# Altium project AC Current Sensor (Multicanal).PrjPcb
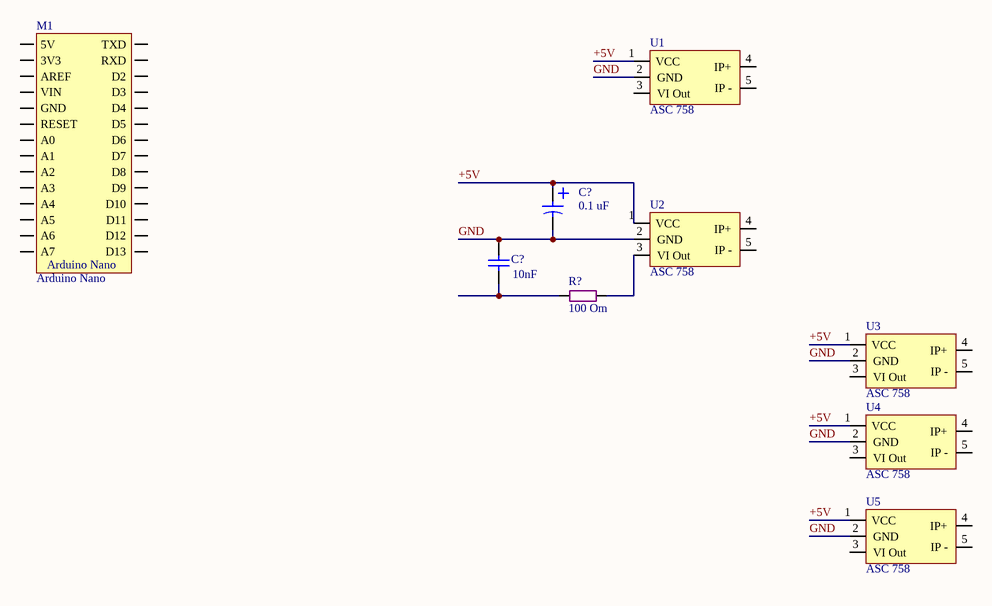
[diagram p0: AC Current Sensor (Multicanal).SchDoc]
1 sheet, 9 parts. Net scope: global (net labels, ports and power ports of the same name join across sheets).
Board file: AC Current Sensor (Multicanal).PcbDoc

## Sheet AC Current Sensor (Multicanal).SchDoc
size A4

### Parts
(Parts that share a designator on the sheet are numbered #1, #2 ... from top to bottom, then left to right.)
C?#1  0.1 uF  [SMD 1206 Tantal (3216)]
C?#2  10nF  [SMD 0805 (2012)]
M1  Arduino Nano  [Arduino Nano]
R?  100 Om  [SMD 0805 (2012)]
U1  ASC 758  [CB-PFF (ACS758)]
U2  ASC 758  [CB-PFF (ACS758)]
U3  ASC 758  [CB-PFF (ACS758)]
U4  ASC 758  [CB-PFF (ACS758)]
U5  ASC 758  [CB-PFF (ACS758)]

### Nets
+5V: C?#1.VCC U1.1(VCC) U2.1(VCC) U3.1(VCC) U4.1(VCC) U5.1(VCC)
GND: C?#1.GND C?#2.1 U1.2(GND) U2.2(GND) U3.2(GND) U4.2(GND) U5.2(GND)
NetC?#2_2: C?#2.2 R?.1
NetR?_2: R?.2 U2.3(VI_Out)

Not connected (* = marked no-connect by the designer): M1 3V3 5V A0 A1 A2 A3 A4 A5 A6 A7 AREF D2 D3 D4 D5 D6 D7 D8 D9 D10 D11 D12 D13 GND RESET RXD TXD VIN; U1 3(VI_Out) 4(IP+) 5(IP_-); U2 4(IP+) 5(IP_-); U3 3(VI_Out) 4(IP+) 5(IP_-); U4 3(VI_Out) 4(IP+) 5(IP_-); U5 3(VI_Out) 4(IP+) 5(IP_-)

### Notes on the sheet
- Title
- Size:
- Date:
- A4
- Number:
- Time:
- Revision:
- Sheet
- of
- File:

### Library data of the parts
C?#1 = Cap Tantal: Capacitor
C?#2 = Cap SMD 0402-1812: Capacitor
R? = Res SMD 0805
U1-U5 = ACS758-xxxx: Current sensor ASC-758; Name: ASC 758